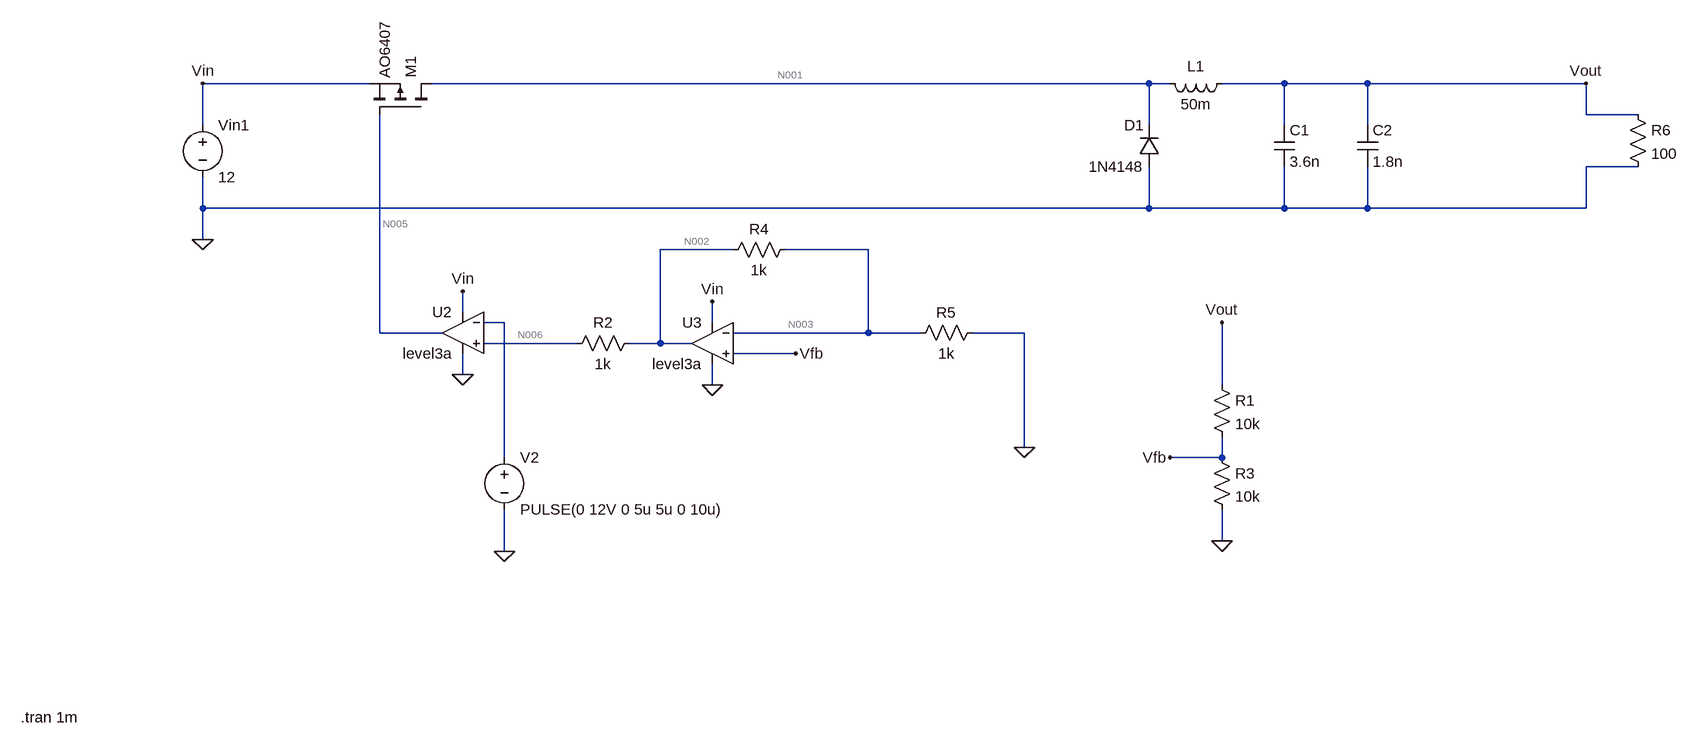
[diagram p0: schematic Buck_with_analog_feedback.asc]
Buck_with_analog_feedback.asc, the LTspice schematic file:
Version 4
SHEET 1 3108 680
WIRE 1088 -1472 832 -1472
WIRE 2288 -1472 1184 -1472
WIRE 2320 -1472 2288 -1472
WIRE 2496 -1472 2400 -1472
WIRE 2624 -1472 2496 -1472
WIRE 2960 -1472 2624 -1472
WIRE 2960 -1424 2960 -1472
WIRE 3040 -1424 2960 -1424
WIRE 832 -1408 832 -1472
WIRE 2288 -1408 2288 -1472
WIRE 2496 -1408 2496 -1472
WIRE 2624 -1408 2624 -1472
WIRE 3040 -1344 2960 -1344
WIRE 832 -1280 832 -1328
WIRE 2288 -1280 2288 -1344
WIRE 2288 -1280 832 -1280
WIRE 2496 -1280 2496 -1344
WIRE 2496 -1280 2288 -1280
WIRE 2624 -1280 2624 -1344
WIRE 2624 -1280 2496 -1280
WIRE 2960 -1280 2960 -1344
WIRE 2960 -1280 2624 -1280
WIRE 832 -1232 832 -1280
WIRE 1648 -1216 1536 -1216
WIRE 1856 -1216 1728 -1216
WIRE 1232 -1120 1232 -1152
WIRE 1296 -1104 1264 -1104
WIRE 1616 -1104 1616 -1136
WIRE 1104 -1088 1104 -1424
WIRE 1200 -1088 1104 -1088
WIRE 1856 -1088 1856 -1216
WIRE 1856 -1088 1648 -1088
WIRE 1936 -1088 1856 -1088
WIRE 2096 -1088 2016 -1088
WIRE 1408 -1072 1264 -1072
WIRE 1536 -1072 1536 -1216
WIRE 1536 -1072 1488 -1072
WIRE 1584 -1072 1536 -1072
WIRE 1744 -1056 1648 -1056
WIRE 1232 -1024 1232 -1056
WIRE 1616 -1008 1616 -1040
WIRE 2400 -1008 2400 -1104
WIRE 2096 -912 2096 -1088
WIRE 1296 -896 1296 -1104
WIRE 2400 -896 2400 -928
WIRE 2400 -896 2320 -896
WIRE 2400 -768 2400 -816
WIRE 1296 -752 1296 -816
FLAG 832 -1232 0
FLAG 2960 -1472 Vout
FLAG 832 -1472 Vin
FLAG 1296 -752 0
FLAG 1232 -1024 0
FLAG 1616 -1008 0
FLAG 1232 -1152 Vin
FLAG 1616 -1136 Vin
FLAG 2096 -912 0
FLAG 2400 -768 0
FLAG 2320 -896 Vfb
FLAG 1744 -1056 Vfb
FLAG 2400 -1104 Vout
SYMBOL voltage 832 -1424 R0
WINDOW 123 0 0 Left 0
WINDOW 39 0 0 Left 0
SYMATTR InstName Vin1
SYMATTR Value 12
SYMBOL pmos 1184 -1424 M270
SYMATTR InstName M1
SYMATTR Value AO6407
SYMBOL diode 2304 -1344 R180
WINDOW 0 24 64 Left 2
WINDOW 3 24 0 Left 2
SYMATTR InstName D1
SYMATTR Value 1N4148
SYMBOL ind 2416 -1488 R90
WINDOW 0 5 56 VBottom 2
WINDOW 3 32 56 VTop 2
SYMATTR InstName L1
SYMATTR Value 50m
SYMBOL cap 2480 -1408 R0
SYMATTR InstName C1
SYMATTR Value 3.6n
SYMBOL voltage 1296 -912 R0
WINDOW 123 0 0 Left 0
WINDOW 39 0 0 Left 0
SYMATTR InstName V2
SYMATTR Value PULSE(0 12V 0 5u 5u 0 10u)
SYMBOL res 1504 -1088 R90
WINDOW 0 0 56 VBottom 2
WINDOW 3 32 56 VTop 2
SYMATTR InstName R2
SYMATTR Value 1k
SYMBOL OpAmps\\UniversalOpAmp3 1616 -1072 M0
SYMATTR InstName U3
SYMATTR Value2 Avol=100Meg GBW=10Meg Slew=10Meg
SYMATTR SpiceLine Ilimit=500m Rail=0 Vos=0 Phimargin=45
SYMATTR SpiceLine2 En=0 Enk=0 In=0 Ink=0 Rin=100G
SYMBOL OpAmps\\UniversalOpAmp3 1232 -1088 M0
SYMATTR InstName U2
SYMATTR Value2 Avol=100Meg GBW=10G Slew=10G
SYMATTR SpiceLine Ilimit=500m Rail=0 Vos=0 Phimargin=45
SYMATTR SpiceLine2 En=0 Enk=0 In=0 Ink=0 Rin=100G
SYMBOL res 1744 -1232 R90
WINDOW 0 0 56 VBottom 2
WINDOW 3 32 56 VTop 2
SYMATTR InstName R4
SYMATTR Value 1k
SYMBOL res 2032 -1104 R90
WINDOW 0 0 56 VBottom 2
WINDOW 3 32 56 VTop 2
SYMATTR InstName R5
SYMATTR Value 1k
SYMBOL res 2384 -1024 R0
SYMATTR InstName R1
SYMATTR Value 10k
SYMBOL res 2384 -912 R0
SYMATTR InstName R3
SYMATTR Value 10k
SYMBOL res 3024 -1440 R0
SYMATTR InstName R6
SYMATTR Value 100
SYMBOL cap 2608 -1408 R0
SYMATTR InstName C2
SYMATTR Value 1.8n
TEXT 552 -496 Left 2 !.tran 1m

The netlist it stands for:
* Buck_with_analog_feedback.asc
Vin1 Vin 0 12
M1 N001 N005 Vin Vin AO6407
D1 0 N001 1N4148
L1 Vout N001 50m
C1 Vout 0 3.6n
V2 N004 0 PULSE(0 12V 0 5u 5u 0 10u)
R2 N002 N006 1k
XU3 Vfb N003 Vin 0 N002 level3a Avol=100Meg GBW=10Meg Slew=10Meg Ilimit=500m Rail=0 Vos=0 Phimargin=45 En=0 Enk=0 In=0 Ink=0 Rin=100G  ; pins In+ In- V+ V- OUT
XU2 N006 N004 Vin 0 N005 level3a Avol=100Meg GBW=10G Slew=10G Ilimit=500m Rail=0 Vos=0 Phimargin=45 En=0 Enk=0 In=0 Ink=0 Rin=100G  ; pins In+ In- V+ V- OUT
R4 N003 N002 1k
R5 0 N003 1k
R1 Vout Vfb 10k
R3 Vfb 0 10k
R6 Vout 0 100
C2 Vout 0 1.8n
.model D D
.lib standard.dio
.model NMOS NMOS
.model PMOS PMOS
.lib standard.mos
.tran 1m
.backanno
.end

* Results of the author's LTspice run, read from the files saved beside the schematic
* Operating Point, zero values left out:
*   V(vin) = 12 V
*   V(n001) = 1.8 µV
*   V(n005) = 12 V
*   V(vout) = 1.8 µV
*   V(n002) = 2.579 mV
*   V(n006) = 2.58 mV
*   V(n003) = 1.29 mV
*   V(vfb) = 1.2 µV
*   Id(M1) = -18.05 nA
*   Is(M1) = 18.05 nA
*   I(L1) = -18.06 nA
*   I(R2) = -59.97 pA
*   I(R4) = -1.29 µA
*   I(R5) = -1.29 µA
*   I(R1) = 59.99 pA
*   I(R3) = 120 pA
*   I(R6) = 18 nA
*   I(Vin1) = -20.03 µA
*   I(V2) = 60 pA
*   Ix(u3:1) = -60 pA
*   Ix(u3:2) = -59.99 pA
*   Ix(u3:3) = 18.31 µA
*   Ix(u3:4) = -16.96 µA
*   Ix(u3:5) = -1.29 µA
*   Ix(u2:1) = -59.97 pA
*   Ix(u2:2) = -60 pA
*   Ix(u2:3) = 1.7 µA
*   Ix(u2:4) = -1.761 µA
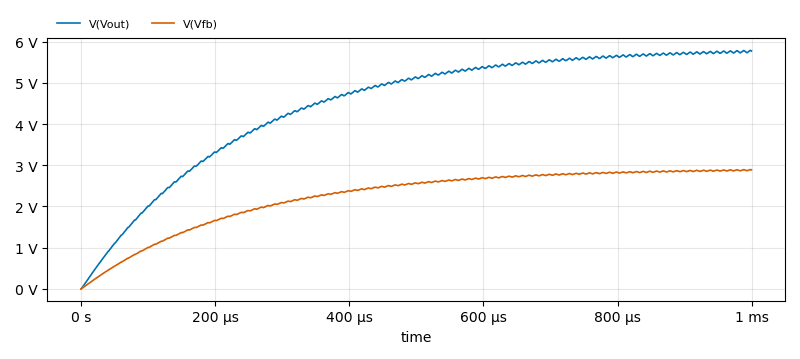
[diagram p1: Transient Analysis of Buck_with_analog_feedback.asc, plotted from the saved traces]
* Transient Analysis, 1 run:
*   V(Vout): min 1.796 µV, max 5.793 V, average 4.472 V, rms 4.712 V, last 5.774 V
*   V(Vfb): min 1.198 µV, max 2.896 V, average 2.236 V, rms 2.356 V, last 2.887 V